# Altium schematic sheet cp2102.SchDoc
size A
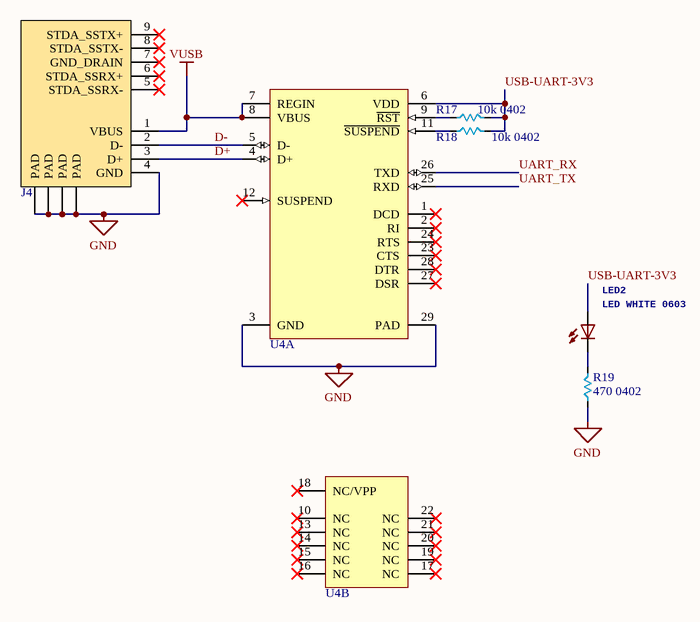
[diagram p0: cp2102.SchDoc]

## Parts
J4  0483930003  [0483930003]  (value not drawn)
LED2  LED WHITE 0603  [LED_0603]
R17  10k 0402  [R0402]
R18  10k 0402  [R0402]
R19  470 0402  [R0402]
U4  CP2102-GM  [QFN28]  (value not drawn)  (parts A,B of 2)

## Nets
GND: J4.4(GND) J4.10(PAD) J4.11(PAD) J4.12(PAD) J4.13(PAD) R19.2 U4.3(GND) U4.29(PAD)
VUSB: J4.1(VBUS) U4.7(REGIN) U4.8(VBUS)
D+: J4.3(D+) U4.4(D+)
D-: J4.2(D-) U4.5(D-)
UART_RX: U4.26(TXD)
UART_TX: U4.25(RXD)
USB-UART-3V3: LED2.A R17.1 R18.1 U4.6(VDD)
NetLED2_C: LED2.C R19.1
NetR17_2: R17.2 U4.9(~{RST})
NetR18_2: R18.2 U4.11(~{SUSPEND})

Not connected (* = marked no-connect by the designer): J4 5(STDA_SSRX-)* 6(STDA_SSRX+)* 7(GND_DRAIN)* 8(STDA_SSTX-)* 9(STDA_SSTX+)*; U4 1(DCD)* 2(RI)* 10(NC)* 12(SUSPEND)* 13(NC)* 14(NC)* 15(NC)* 16(NC)* 17(NC)* 18(NC/VPP)* 19(NC)* 20(NC)* 21(NC)* 22(NC)* 23(CTS)* 24(RTS)* 27(DSR)* 28(DTR)*

## Library data of the parts
J4 = 0483930003: Conn USB Type A F 9 POS 2mm/2.5mm Solder RA Thru-Hole 9 Terminal 1 Port Embossed T/R; Manufacturer: Molex; Number of Contacts: 9; Gender: Receptacle; Supplier 1: Digi-Key; Manufacturer Part Number: 0483930003; RoHS: Yes; Category: Connectors; Stock 1: 7788; Pricing 1: 1=1.74000, 10=1.57900, 25=1.48240, 50=1.41780, 100=1.35340 (USD); Mount: Through Hole,Horizontal; Packaging: Tape and Reel; Termination: Solder; Orientation: Right Angle; Connector Type: USB; Package Quantity: 300; Radiation Hardening: No; ComponentLink1URL: https://datasheet.ciiva.com/29660/987651-0181-29660134.pdf?src-supplier=Digi-Key; ComponentLink1Description: https://datasheet.ciiva.com/29660/987651-0181-29660134.pdf?src-supplier=Digi-Key; ComponentLink2URL: https://datasheet.ciiva.com/29660/987651-0181-29660135.pdf?src-supplier=Digi-Key; ComponentLink2Description: https://datasheet.ciiva.com/29660/987651-0181-29660135.pdf?src-supplier=Digi-Key; Supplier Part Number 1: WM10413CT-ND
LED2 = LED_ESML0603: LED   Source: http://www.osram.convergy.de   Source: www.luxeon.com   Source: www.kingbright.com; Manufacturer: Dialight; Manufacturer Part Number: 5988070107F; Description 1: DIALIGHT - 5988070107F - LED, 0603, GREEN, 20MCD, 566NM; Color: Green; Lens Color: Colorless,Clear; Forward Voltage: 2V; Forward Current: 20mA; Wavelength: 570nm; Luminous Intensity: 20mcd; Viewing Angle: 140°; Lens Style: Flat,Rectangular,Diffused,Colorless,Clear; Dominant Wavelength: 568nm; Number of Elements: 1; Power Dissipation: 60mW; Reverse Voltage: 5V; Lens Transparency: Clear; Lens Size: 0.8mm; SPICEMODEL: NONE; SPICEPREFIX: D; SPICETYPE: diode; Supplier 1: Digi-Key; Supplier Part Number 1: 350-2035-6-ND; Stock: 221494; Pricing: 1=0.48, 10=0.346, 25=0.2652, 100=0.1731, 250=0.12692, 500=0.1077, 1000=0.08846 (USD); Mount: Surface Mount; Case/Package: 0603; Number of Pins: 2; Case Code (Metric): 1608; Case Code (Imperial): 0603; Min Operating Temperature: -30°C; Max Operating Temperature: 100°C; Package Quantity: 4000; Packaging: Tape and Reel; Illumination Color: Green; Test Current: 20mA; Number of LEDs: 1; Length: 1.6mm; Height: 0.7mm; Depth: 0.8mm; Width: 0.8mm; Radiation Hardening: No; Lead Free: Lead Free; REACH SVHC: No SVHC; ComponentLink1URL: http://www.mouser.com/ds/2/109/SMT_selector_guide-267443.pdf?src-supplier=Mouser; ComponentLink1Description: http://www.mouser.com/ds/2/109/SMT_selector_guide-267443.pdf?src-supplier=Mouser; ComponentLink2URL: http://uk.rs-online.com/webdocs/0ae2/0900766b80ae2975.pdf?src-supplier=RSComponents; ComponentLink2Description: http://uk.rs-online.com/webdocs/0ae2/0900766b80ae2975.pdf?src-supplier=RSComponents; ComponentLink3URL: http://www.farnell.com/datasheets/1720200.pdf?src-supplier=Element14; ComponentLink3Description: http://www.farnell.com/datasheets/1720200.pdf?src-supplier=Element14; ComponentLink4URL: https://media.digikey.com/pdf/Data%20Sheets/Dialight%20PDFs/598_Series_0603_Pkg.pdf?src-supplier=Digi-Key; ComponentLink4Description: https://media.digikey.com/pdf/Data%20Sheets/Dialight%20PDFs/598_Series_0603_Pkg.pdf?src-supplier=Digi-Key; ComponentLink5URL: http://www.farnell.com/datasheets/1484480.pdf?src-supplier=Element14; ComponentLink5Description: http://www.farnell.com/datasheets/1484480.pdf?src-supplier=Element14; ComponentLink6URL: https://www.alliedelec.com/m/d/745256ca487aea7b70ea31e2d673d5bb.pdf?src-supplier=Allied+Electronics; ComponentLink6Description: https://www.alliedelec.com/m/d/745256ca487aea7b70ea31e2d673d5bb.pdf?src-supplier=Allied+Electronics; ComponentLink7URL: http://www.onlinecomponents.com/productFiles/mf-DIA/mdei5980603.pdf?src-supplier=Onlinecomponents.com; ComponentLink7Description: http://www.onlinecomponents.com/productFiles/mf-DIA/mdei5980603.pdf?src-supplier=Onlinecomponents.com; ComponentLink8URL: https://www.verical.com/server-webapp/html/getDatasheet?partID=146438&src-supplier=Verical; ComponentLink8Description: https://www.verical.com/server-webapp/html/getDatasheet?partID=146438&src-supplier=Verical; ComponentLink9URL: http://www.dialight.com/Assets/Brochures_And_Catalogs/Indication/SMT_selector_guide.pdf?src-supplier=Future+Electronics; ComponentLink9Description: http://www.dialight.com/Assets/Brochures_And_Catalogs/Indication/SMT_selector_guide.pdf?src-supplier=Future+Electronics
R17 R18 = R-10k-0402
R19 = R-470-0402: Manufacturer: Yageo; Manufacturer Part Number: RC0402JR-07470RL; Description 1: RES SMD 470 OHM 5% 1/16W 0402; Tolerance: 5%; Voltage Rating: 50V; Resistance: 470R; Power Rating: 62.5mW; Temperature Coefficient: 100ppm/°C; Max Power Dissipation: 63mW; Supplier 1: Digi-Key; Supplier Part Number 1: 311-470JRDKR-ND; Stock: 2903670; Pricing: 1=0.1, 10=0.013, 100=0.0055, 1000=0.00245, 2500=0.00212, 5000=0.00176 (USD); Case/Package: 0402; Case Code (Metric): 1005; Case Code (Imperial): 0402; Min Operating Temperature: -55°C; Max Operating Temperature: 155°C; Packaging: Tape and Reel; Package Quantity: 1; Termination: SMD/SMT; Composition: Thick Film; Features: Moisture Resistant; Number of Terminations: 2; Military Standard: Not; Working Voltage: 50V; Length: 1mm; Height: 0.016inch; Width: 0.02inch; Depth: 0.5mm; REACH SVHC: Unknown; Lead Free: Lead Free; ComponentLink1URL: http://www.yageo.com/documents/recent/PYu-RC_Group_51_RoHS_L_10.pdf?src-supplier=Digi-Key; ComponentLink1Description: http://www.yageo.com/documents/recent/PYu-RC_Group_51_RoHS_L_10.pdf?src-supplier=Digi-Key; ComponentLink2URL: http://www.farnell.com/datasheets/1018594.pdf?src-supplier=Element14; ComponentLink2Description: http://www.farnell.com/datasheets/1018594.pdf?src-supplier=Element14; ComponentLink3URL: http://www.mouser.com/ds/2/447/PYu-RC0402_51_RoHS_L_6_r-8721.pdf?src-supplier=Mouser; ComponentLink3Description: http://www.mouser.com/ds/2/447/PYu-RC0402_51_RoHS_L_6_r-8721.pdf?src-supplier=Mouser
U4 = CP2102-GM: USB-UART Bridge